# Altium project Bluetooth_Amplifier_Rev_3.PrjPcb
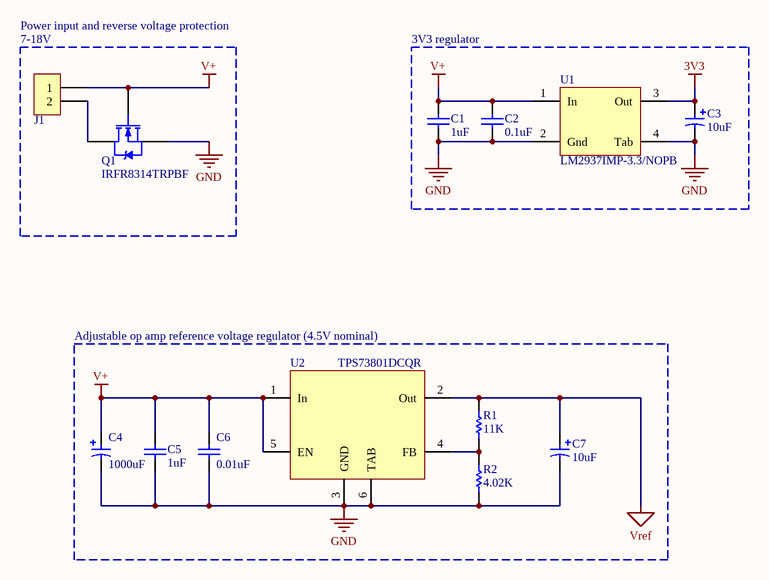
[diagram p0: Power_Supply.SchDoc]
5 sheets, 142 parts. Net scope: global (net labels, ports and power ports of the same name join across sheets).
Board file: Bluetooth_Amplifier.PcbDoc
Sheets:
  Power_Supply.SchDoc
  BC127.SchDoc
  Input_Section.SchDoc
  Power_Amplifier.SchDoc
  Filter_Section.SchDoc

## Sheet Power_Supply.SchDoc: Power Supply
size A4; Author: Yifei Li; DocumentNumber: 1; SheetNumber: 1; SheetTotal: 6

### Parts
C1  1uF  [CAPC1608X09N]
C2  0.1uF  [CAPC1608X09N]
C3  10uF  [CAPMP3216X18N]
C4  1000uF  [Nichicon UVZ 5mm]
C5  1uF  [CAPC1608X09N]
C6  0.01uF  [CAPC1608X09N]
C7  10uF  [CAPMP3216X18N]
J1  TERMINAL BLOCK 2POS  [TERMINAL BLOCK 5MM 2POS]  (value not drawn)
Q1  IRFR8314TRPBF  [DPAK229P991X239-3N]
R1  11K  [RESC1608X06N]
R2  4.02K  [RESC1608X06N]
U1  LM2937IMP-3.3/NOPB  [SOT230P700X180-4N (DCY)]
U2  TPS73801DCQR  [SOT127P705X180-6M (DCQ)]

### Blocks framed on the sheet
3V3 regulator: C1-C3 U1
Adjustable op amp reference voltage regulator (4.5V nominal): C4-C7 R1 R2 U2

### Nets
3V3: C3.1 U1.3(Out)
GND: C1.2 C2.1 C3.2 C4.2 C5.2 C6.1 C7.2 Q1.3(S) R2.1 U1.2(Gnd) U1.4(Tab) U2.3(GND) U2.6(TAB)
V+: C1.1 C2.2 C4.1 C5.1 C6.2 J1.1 Q1.1(G) U1.1(In) U2.1(In) U2.5(EN)
Vref: C7.1 R1.2 U2.2(Out)
NetJ1_2: J1.2 Q1.4(D)
NetR1_1: R1.1 R2.2 U2.4(FB)

### Notes on the sheet
- Power input and reverse voltage protection
- (near J1) 7-18V

### Library data of the parts
C1 C5 = CAP CER 1uF 0603: Manufacturer: Murata; Manufacturer Part Number: GRM188R7YA105KA12D; Voltage: 35V; Rating: X7R; Tolerance: 10%; Value: 1uF; Digikey Part Number: 490-10487-1-ND
C2 = CAP CER 0.1uF 0603: Voltage: 50V; Rating: X7R; Tolerance: 10%; Value: 0.1uF; Digikey Part Number: 490-1519-1-ND; Package: 0603
C3 C7 = CAP TANT 10uF 1.8 OHM 10V 1206: Voltage: 10V; Tolerance: 10%; ESR: 1.8 Ohm; Digikey Part Number: 399-8431-1-ND; Value: 10uF
C4 = CAP ALUM 1000uF SMD: Input Bulk Cap; Manufacturer: Nichicon; Voltage: 25V; Tolerance: 20%; Digikey Part Number: 493-1305-ND; Value: 1000uF
C6 = CAP CER 0.01uF 0603: Manufacturer: Murata; Rating: C0G; Value: 0.01uF; Digikey Part Number: 490-9666-1-ND
Q1 = MOSFET_N_CH_30V_179A_D2PAK: Reverse Voltage Power MOSFET; Manufacturer: Infineon Technologies; VDS: 30V; Rds On (Max): 2.2 mOhm @ 90A, 10V; Digikey Part Number: IRFR8314TRPBFCT-ND; Value: IRFR8314TRPBF
R1 = RES 11K 0603: Manufacturer: Yageo; Manufacturer Part Number: RC0603FR-0711KL; Tolerance: 1%; Power: 0.1W; Type: RES; Footprint: 0603; Temperature: 155dC; Digikey Part Number: 311-11.0KHRCT-ND; Value: 11K
R2 = RES 4.02K 0603: Tolerance: 1%; Type: RES; Footprint: 0603; Value: 4.02K; Digikey Part Number: 311-4.02KHRCT-ND
U2 = TPS73801DCQR: Adjustable 1.21V-20V 1A Regulator; Digikey Part Number: 296-39489-1-ND; Value: TPS73801DCQR
J1 = TERMINAL BLOCK 2POS: Digikey Part Number: ED2561-ND
U1 = LM2937IMP-3.3/NOPB: Digikey Part Number: LM2937IMP-3.3/NOPBCT-ND

## Sheet BC127.SchDoc
size A4; DocumentNumber: 2; SheetNumber: 2; SheetTotal: 6
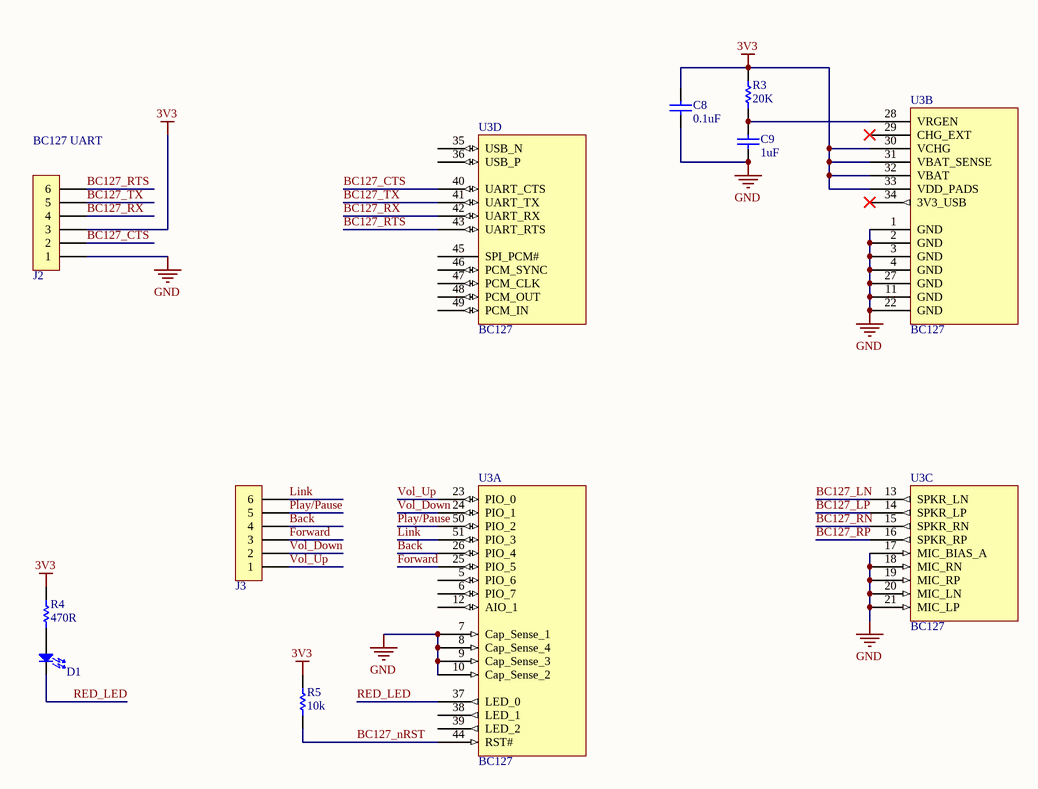
[diagram p1: BC127.SchDoc]

### Parts
C8  0.1uF  [CAPC1608X09N]
C9  1uF  [CAPC1608X09N]
D1  LED 0603  [DIOM1608X08N]  (value not drawn)
J2  6POS THRU HOLE 2.0MM  [JST PH-6]  (value not drawn)
J3  6POS THRU HOLE 2.0MM  [JST PH-6]  (value not drawn)
R3  20K  [RESC1608X06N]
R4  470R  [RESC1608X06N]
R5  10k  [RESC1608X06N]
U3  BC127  [BC127]  (parts A,B,C,D of 4)

### Nets
3V3: C8.2 J2.3 R3.2 R4.2 R5.2 U3.30(VCHG) U3.31(VBAT_SENSE) U3.32(VBAT) U3.33(VDD_PADS)
GND: C8.1 C9.1 J2.1 U3.1(GND) U3.2(GND) U3.3(GND) U3.4(GND) U3.7(Cap_Sense_1) U3.8(Cap_Sense_4) U3.9(Cap_Sense_3) U3.10(Cap_Sense_2) U3.11(GND) U3.17(MIC_BIAS_A) U3.18(MIC_RN) U3.19(MIC_RP) U3.20(MIC_LN) U3.21(MIC_LP) U3.22(GND) U3.27(GND)
Back: J3.4 U3.26(PIO_4)
BC127_CTS: J2.2 U3.40(UART_CTS)
BC127_LN: U3.13(SPKR_LN)
BC127_LP: U3.14(SPKR_LP)
BC127_nRST: R5.1 U3.44(RST#)
BC127_RN: U3.15(SPKR_RN)
BC127_RP: U3.16(SPKR_RP)
BC127_RTS: J2.6 U3.43(UART_RTS)
BC127_RX: J2.4 U3.42(UART_RX)
BC127_TX: J2.5 U3.41(UART_TX)
Forward: J3.3 U3.25(PIO_5)
Link: J3.6 U3.51(PIO_3)
Play/Pause: J3.5 U3.50(PIO_2)
RED_LED: D1.1(K2) U3.37(LED_0)
Vol_Down: J3.2 U3.24(PIO_1)
Vol_Up: J3.1 U3.23(PIO_0)
NetC9_2: C9.2 R3.1 U3.28(VRGEN)
NetD1_2: D1.2(A2) R4.1

Not connected (* = marked no-connect by the designer): U3 5(PIO_6) 6(PIO_7) 12(AIO_1) 29(CHG_EXT)* 34(3V3_USB)* 35(USB_N) 36(USB_P) 38(LED_1) 39(LED_2) 45(SPI_PCM#) 46(PCM_SYNC) 47(PCM_CLK) 48(PCM_OUT) 49(PCM_IN)

### Notes on the sheet
- (near J2) BC127 UART

### Library data of the parts
C8 = CAP CER 0.1uF 0603: as C2 on sheet Power_Supply; Value: 0.1uF; Digikey Part Number: 490-1519-1-ND; Package: 0603
C9 = CAP CER 1uF 0603: as C1 on sheet Power_Supply; Value: 1uF; Digikey Part Number: 490-10487-1-ND
D1 = LED 0603: Voltage: 2.2V; Configuration: Single; Current: 20mA; Footprint: 0603; Temperature: 85dC; Digikey Part Number: 160-1447-1-ND
R3 = RES 20K 0603: Tolerance: 1%; Power: 0.1W; Footprint: 0603; Value: 20K; Digikey Part Number: 311-20.0KHRCT-ND
R4 = RES 470R 0603: Tolerance: 1%; Power: 0.25W; Type: RES; Footprint: 0603; Value: 470R; Digikey Part Number: 311-470HRCT-ND
R5 = RES 10K 0603: Manufacturer: Yageo; Manufacturer Part Number: RC0603FR-0710KL; Tolerance: 1%; Power: 0.1W; Type: RES; Footprint: 0603; Temperature: 155dC; Digikey Part Number: 311-10.0KHRCT-ND; Value: 10k
J2 J3 = 6POS THRU HOLE 2.0MM: Digikey Part Number: 455-1708-ND

## Sheet Input_Section.SchDoc
size A4; DocumentNumber: 3; SheetNumber: 3; SheetTotal: 6
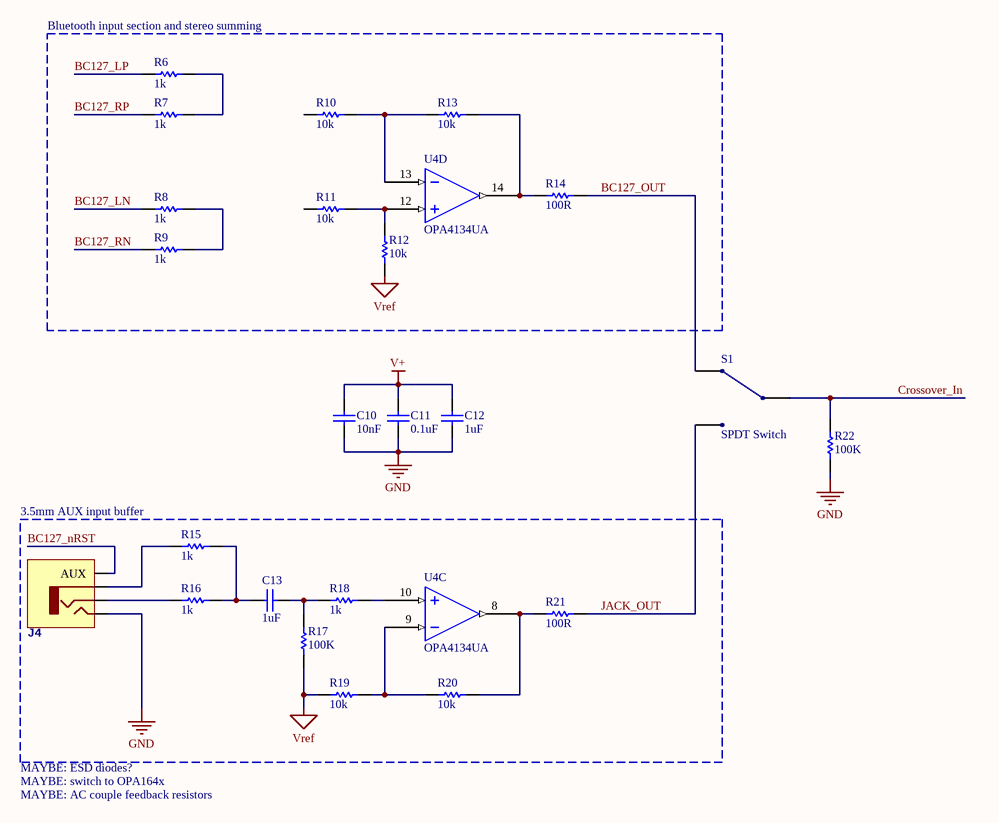
[diagram p2: Input_Section.SchDoc]

### Parts
C10  10nF  [CAPC1608X09N]
C11  0.1uF  [CAPC1608X09N]
C12  1uF  [CAPC1608X09N]
C13  1uF  [CAP Radial 5mm]
J4  3.5mm Audio Jack  [JST PH-4]  (value not drawn)
R6  1k  [RESC1608X06N]
R7  1k  [RESC1608X06N]
R8  1k  [RESC1608X06N]
R9  1k  [RESC1608X06N]
R10  10k  [RESC1608X06N]
R11  10k  [RESC1608X06N]
R12  10k  [RESC1608X06N]
R13  10k  [RESC1608X06N]
R14  100R  [RESC1608X06N]
R15  1k  [RESC1608X06N]
R16  1k  [RESC1608X06N]
R17  100K  [RESC1608X06N]
R18  1k  [RESC1608X06N]
R19  10k  [RESC1608X06N]
R20  10k  [RESC1608X06N]
R21  100R  [RESC1608X06N]
R22  100K  [RESC1608X06N]
S1  SPDT Switch  [JST PH-4]
U4  OPA4134UA  [SOIC127P600X175-14N]  (parts C,D of 4)

### Blocks framed on the sheet
Bluetooth input section and stereo summing: R6-R14 U4
3.5mm AUX input buffer: C13 J4 R15-R21 U4

### Nets
GND: C10.1 C11.1 C12.2 J4.4(LEFT) R22.1 U4.11(V-)
V+: C10.2 C11.2 C12.1
Vref: R12.1 R17.1 R19.1
BC127_LN: R8.1
BC127_LP: R6.1
BC127_nRST: J4.1(AUX)
BC127_OUT: R14.2 S1.2
BC127_RN: R9.1
BC127_RP: R7.1
Crossover_In: R22.2 S1.4
JACK_OUT: R21.2 S1.3
NetC13_1: C13.1 R15.2 R16.2
NetC13_2: C13.2 R17.2 R18.1
NetJ4_2: J4.2(SLEEVE) R15.1
NetJ4_3: J4.3(RIGHT) R16.1
NetR6_2: R6.2 R7.2
NetR8_2: R8.2 R9.2
NetR10_2: R10.2 R13.1 U4.13(-In_D)
NetR11_2: R11.2 R12.2 U4.12(+In_D)
NetR13_2: R13.2 R14.1 U4.14(Out_D)
NetR18_2: R18.2 U4.10(+In_C)
NetR19_2: R19.2 R20.1 U4.9(-In_C)
NetR20_2: R20.2 R21.1 U4.8(Out_C)

Not connected (* = marked no-connect by the designer): R10 1; R11 1; S1 1

### Notes on the sheet
- MAYBE: ESD diodes?
- MAYBE: switch to OPA164x
- MAYBE: AC couple feedback resistors

### Library data of the parts
C10 = CAP CER 10nF 0603: Bypass caps; Manufacturer: Murata; Value: 10nF; Digikey Part Number: 490-9666-1-ND
C11 = CAP CER 0.1uF 0603: as C2 on sheet Power_Supply; Value: 0.1uF; Digikey Part Number: 490-1519-1-ND; Package: 0603
C12 = CAP CER 1uF 0603: as C1 on sheet Power_Supply; Value: 1uF; Digikey Part Number: 490-10487-1-ND
C13 = CAP FILM 1uF RADIAL 5MM: Audio coupling cap; Manufacturer: EPCOS (TDK); Manufacturer P/N: B32529C105J; Voltage: 63V; Value: 1uF; Digikey Part Number: 495-1119-ND
R6-R9 R15 R16 R18 = RES 1K 0603: Manufacturer: Panasonic; Manufacturer Part Number: ERJ-PA3F1001V; Tolerance: 1%; Power: 0.25W; Type: RES; Footprint: 0603; Temperature: 155dC; Digikey Part Number: P1.0KBYCT-ND; Value: 1k
R10-R13 R19 R20 = RES 10K 0603: as R5 on sheet BC127; Type: RES; Footprint: 0603; Temperature: 155dC; Digikey Part Number: 311-10.0KHRCT-ND; Value: 10k
R14 R21 = RES 100R 0603: Tolerance: 1%; Power: 0.25W; Type: RES; Footprint: 0603; Digikey Part Number: 541-100SACT-ND; Value: 100R
R17 R22 = RES 100K 0603: Tolerance: 1%; Power: 0.1W; Footprint: 0603; Value: 100K; Digikey Part Number: 311-100KHRCT-ND
U4 = OPA4134UA: Quad OPAx134 Operational Amplifier; Digikey Part Number: 296-26284-1-ND; Value: OPA4134UA

## Sheet Power_Amplifier.SchDoc
size A4; DocumentNumber: 4; SheetNumber: 4; SheetTotal: 6
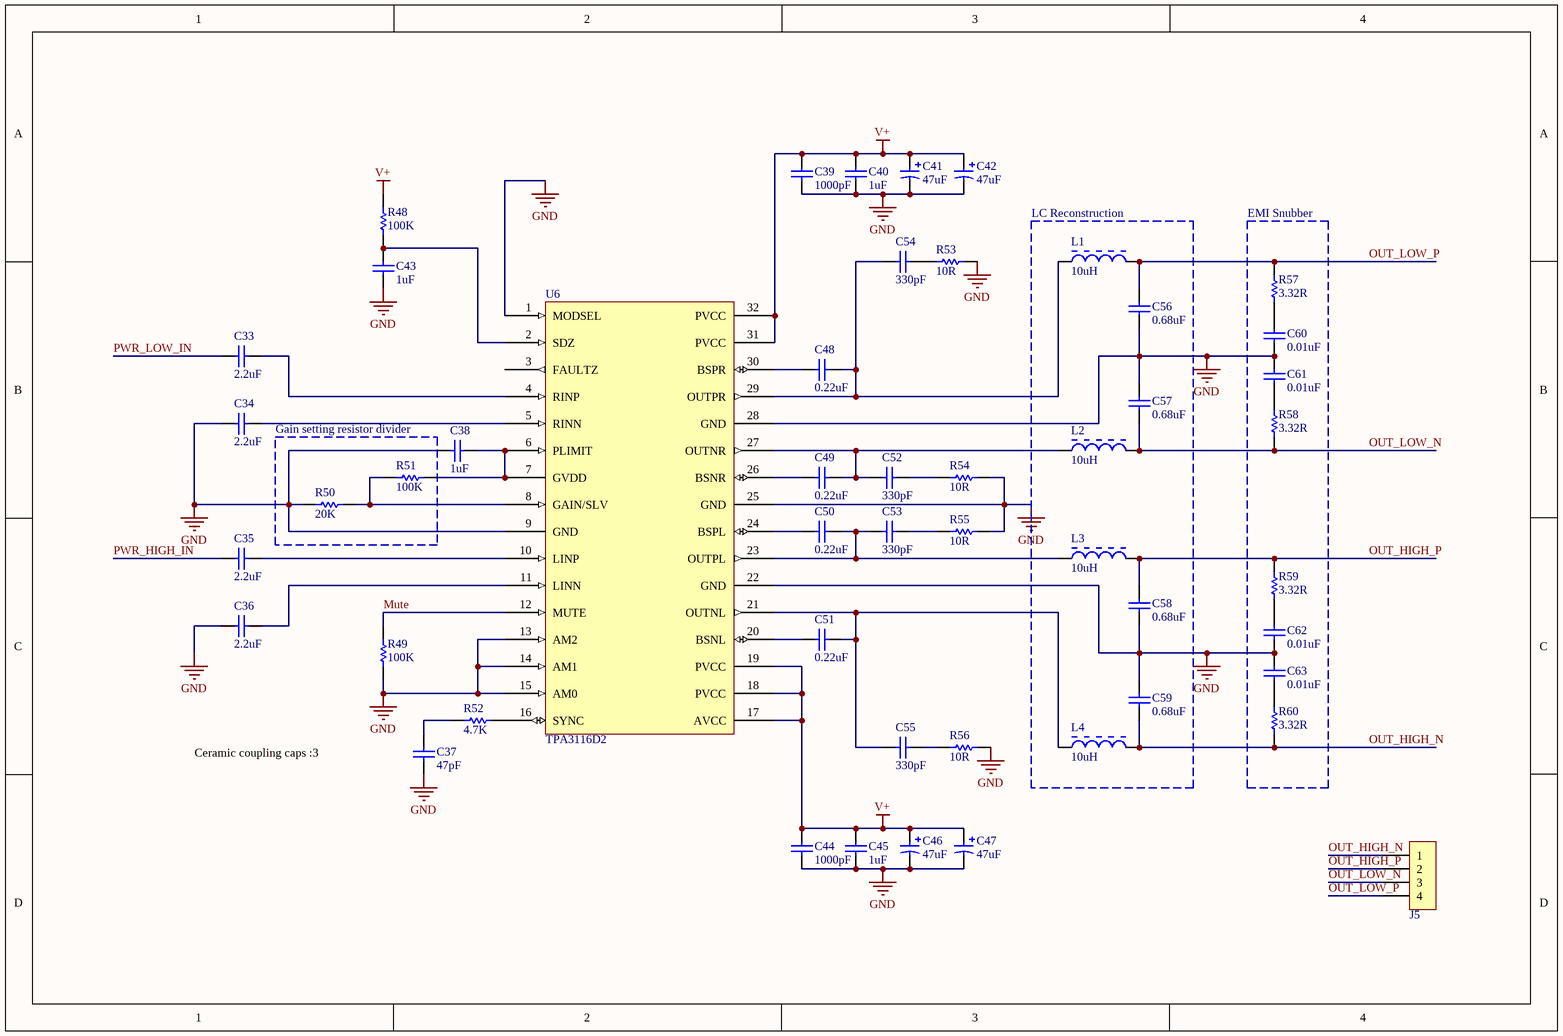
[diagram p3: Power_Amplifier.SchDoc]

### Parts
C33  2.2uF  [CAP Radial 7.5MM]
C34  2.2uF  [CAP Radial 7.5MM]
C35  2.2uF  [CAP Radial 7.5MM]
C36  2.2uF  [CAP Radial 7.5MM]
C37  47pF  [CAPC1608X09N]
C38  1uF  [CAPC1608X09N]
C39  1000pF  [CAPC1608X09N]
C40  1uF  [CAPC1608X09N]
C41  47uF  [CAP_EEFK_D]
C42  47uF  [CAP_EEFK_D]
C43  1uF  [CAPC1608X09N]
C44  1000pF  [CAPC1608X09N]
C45  1uF  [CAPC1608X09N]
C46  47uF  [CAP_EEFK_D]
C47  47uF  [CAP_EEFK_D]
C48  0.22uF  [CAPC1608X09N]
C49  0.22uF  [CAPC1608X09N]
C50  0.22uF  [CAPC1608X09N]
C51  0.22uF  [CAPC1608X09N]
C52  330pF  [CAPC1608X09N]
C53  330pF  [CAPC1608X09N]
C54  330pF  [CAPC1608X09N]
C55  330pF  [CAPC1608X09N]
C56  0.68uF  [CAP Radial 5mm]
C57  0.68uF  [CAP Radial 5mm]
C58  0.68uF  [CAP Radial 5mm]
C59  0.68uF  [CAP Radial 5mm]
C60  0.01uF  [CAPC1608X09N]
C61  0.01uF  [CAPC1608X09N]
C62  0.01uF  [CAPC1608X09N]
C63  0.01uF  [CAPC1608X09N]
J5  TERMINAL BLOCK 4POS  [TERMINAL BLOCK 5MM 4POS]  (value not drawn)
L1  10uH  [ICE 1D10A]
L2  10uH  [ICE 1D10A]
L3  10uH  [ICE 1D10A]
L4  10uH  [ICE 1D10A]
R48  100K  [RESC1608X06N]
R49  100K  [RESC1608X06N]
R50  20K  [RESC1608X06N]
R51  100K  [RESC1608X06N]
R52  4.7K  [RESC1608X06N]
R53  10R  [RESC1608X06N]
R54  10R  [RESC1608X06N]
R55  10R  [RESC1608X06N]
R56  10R  [RESC1608X06N]
R57  3.32R  [RESC1608X06N]
R58  3.32R  [RESC1608X06N]
R59  3.32R  [RESC1608X06N]
R60  3.32R  [RESC1608X06N]
U6  TPA3116D2  [DAP0032A]

### Blocks framed on the sheet
LC Reconstruction: C56-C59 L1-L4
EMI Snubber: C60-C63 R57-R60
Gain setting resistor divider: R50 R51

### Nets
GND: C34.1 C36.1 C37.1 C38.2 C39.1 C40.1 C41.2 C42.2 C43.1 C44.1 C45.1 C46.2 C47.2 C56.1 C57.2 C58.1 C59.2 C60.1 C61.2 C62.1 C63.2 R49.1 R50.1 R53.2 R54.2 R55.2 R56.2 U6.1(MODSEL) U6.9(GND) U6.13(AM2) U6.14(AM1) U6.15(AM0) U6.22(GND) U6.25(GND) U6.28(GND) U6.33(POWERPAD)
V+: C39.2 C40.2 C41.1 C42.1 C44.2 C45.2 C46.1 C47.1 R48.2 U6.17(AVCC) U6.18(PVCC) U6.19(PVCC) U6.31(PVCC) U6.32(PVCC)
Mute: R49.2 U6.12(MUTE)
OUT_HIGH_N: C59.1 J5.1 L4.2 R60.1
OUT_HIGH_P: C58.2 J5.2 L3.2 R59.2
OUT_LOW_N: C57.1 J5.3 L2.2 R58.1
OUT_LOW_P: C56.2 J5.4 L1.2 R57.2
PWR_HIGH_IN: C35.1
PWR_LOW_IN: C33.1
NetC33_2: C33.2 U6.4(RINP)
NetC34_2: C34.2 U6.5(RINN)
NetC35_2: C35.2 U6.10(LINP)
NetC36_2: C36.2 U6.11(LINN)
NetC37_2: C37.2 R52.1
NetC38_1: C38.1 R51.2 U6.6(PLIMIT) U6.7(GVDD)
NetC43_2: C43.2 R48.1 U6.2(SDZ)
NetC48_1: C48.1 U6.30(BSPR)
NetC48_2: C48.2 C54.1 L1.1 U6.29(OUTPR)
NetC49_1: C49.1 U6.26(BSNR)
NetC49_2: C49.2 C52.1 L2.1 U6.27(OUTNR)
NetC50_1: C50.1 U6.24(BSPL)
NetC50_2: C50.2 C53.1 L3.1 U6.23(OUTPL)
NetC51_1: C51.1 U6.20(BSNL)
NetC51_2: C51.2 C55.1 L4.1 U6.21(OUTNL)
NetC52_2: C52.2 R54.1
NetC53_2: C53.2 R55.1
NetC54_2: C54.2 R53.1
NetC55_2: C55.2 R56.1
NetC60_2: C60.2 R57.1
NetC61_1: C61.1 R58.2
NetC62_2: C62.2 R59.1
NetC63_1: C63.1 R60.2
NetR50_2: R50.2 R51.1 U6.8(GAIN/SLV)
NetR52_2: R52.2 U6.16(SYNC)

Not connected (* = marked no-connect by the designer): U6 3(FAULTZ)

### Notes on the sheet
- Ceramic coupling caps :3

### Library data of the parts
C33-C36 = CAP FILM 2.2uF RADIAL 7.5MM: Audio coupling cap; Manufacturer: EPCOS (TDK); Manufacturer P/N: B32520C225K; Voltage: 40V; Value: 2.2uF; Digikey Part Number: 495-4814-ND
C37 = CAP CER 47pF 0603: Rating: C0G; Voltage: 50V; Value: 47pF; Digikey Part Number: 490-1419-1-ND
C38 C40 C43 C45 = CAP CER 1uF 0603: as C1 on sheet Power_Supply; Value: 1uF; Digikey Part Number: 490-10487-1-ND
C39 C44 = CAP CER 1000pF 0603: Manufacturer: Murata; Rating: C0G; Voltage: 50V; Value: 1000pF; Digikey Part Number: 490-1451-1-ND
C41 C42 C46 C47 = CAP ALUM 47uF SMD: Manufacturer: Panasonic; Voltage: 35V; Digikey Part Number: PCE3842CT-ND; Value: 47uF
C48-C51 = CAP CER 0.22uF 0603: Manufacturer: Murata; Voltage: 50V; Rating: X7R; Value: 0.22uF; Digikey Part Number: 1276-1111-1-ND
C52-C55 = CAP CER 330pF 0603: Manufacturer: Murata; Rating: C0G; Voltage: 50V; Value: 330pF; Digikey Part Number: 490-1439-1-ND
C56-C59 = CAP 0.68uF Radial 5mm: Output Cap; Manufacturer: EPCOS (TDK); Voltage: 63V; Value: 0.68uF; Digikey Part Number: 495-1114-ND
C60-C63 = CAP CER 0.01uF 0603: Manufacturer: Murata; Rating: C0G; Value: 0.01uF; Digikey Part Number: 490-9666-1-ND
L1-L4 = IND 10uH 4.5A THRU: Manufacturer: Ice Components; Manufacturer P/N: 1D10A-100M; DCR: 20.5mOhm; Value: 10uH; Mouser P/N: 911-1D10A-100M
R48 R49 R51 = RES 100K 0603: Tolerance: 1%; Power: 0.1W; Footprint: 0603; Value: 100K; Digikey Part Number: 311-100KHRCT-ND
R50 = RES 20K 0603: Tolerance: 1%; Power: 0.1W; Footprint: 0603; Value: 20K; Digikey Part Number: 311-20.0KHRCT-ND
R52 = RES 4.7K 0603: Tolerance: 1%; Type: RES; Footprint: 0603; Value: 4.7K; Digikey Part Number: 311-4.70KHRCT-ND
R53-R56 = RES 10R 0603: Tolerance: 1%; Power: 0.25W; Type: RES; Footprint: 0603; Digikey Part Number: RHM10.0ADCT-ND; Value: 10R
R57-R60 = RES 3.32R 0603: Tolerance: 1%; Power: 0.1W; Type: RES; Footprint: 0603; Digikey Part Number: 311-3.32HRCT-ND; Value: 3.32R
J5 = TERMINAL BLOCK 4POS: Digikey Part Number: ED2563-ND
U6 = TPA3116D2: Digikey Part Number: 296-39337-1-ND

## Sheet Filter_Section.SchDoc
size A3; DocumentNumber: 5; SheetNumber: 5; SheetTotal: 6
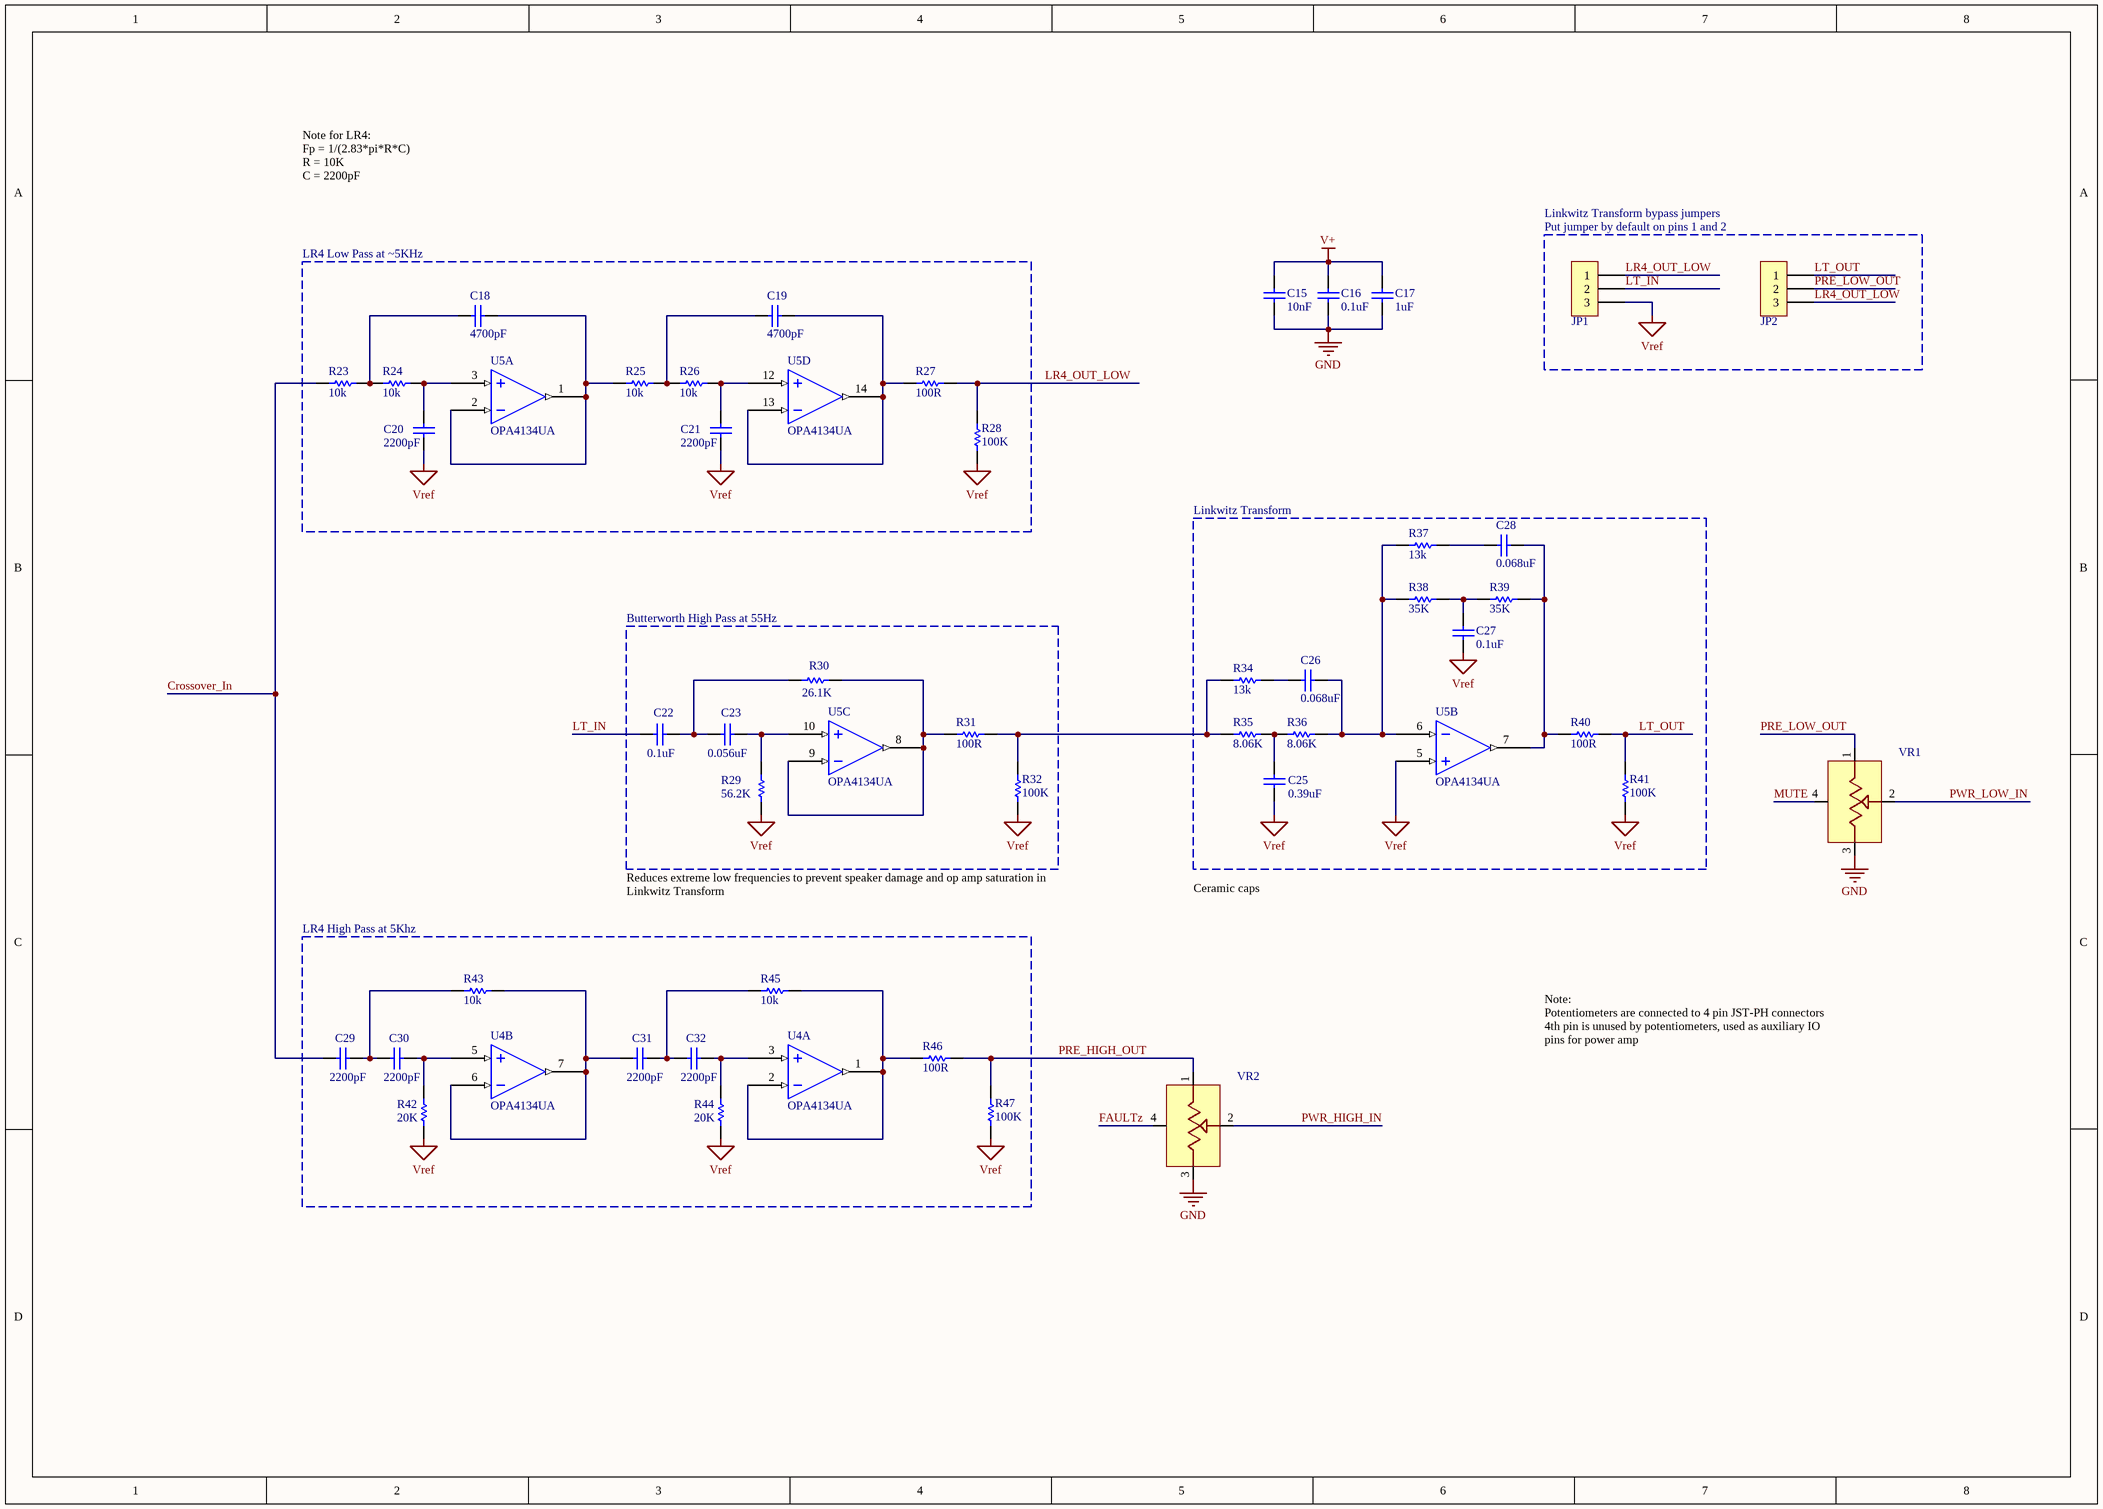
[diagram p4: Filter_Section.SchDoc]

### Parts
C15  10nF  [CAPC1608X09N]
C16  0.1uF  [CAPC1608X09N]
C17  1uF  [CAPC1608X09N]
C18  4700pF  [CAPC1608X09N]
C19  4700pF  [CAPC1608X09N]
C20  2200pF  [CAPC1608X09N]
C21  2200pF  [CAPC1608X09N]
C22  0.1uF  [CAPC3216X18N]
C23  0.056uF  [CAPC3216X18N]
C25  0.39uF  [CAP Radial 5mm]
C26  0.068uF  [CAPC3216X18N]
C27  0.1uF  [CAPC3216X18N]
C28  0.068uF  [CAPC3216X18N]
C29  2200pF  [CAPC1608X09N]
C30  2200pF  [CAPC1608X09N]
C31  2200pF  [CAPC1608X09N]
C32  2200pF  [CAPC1608X09N]
JP1  JUMPER 3POS THRU HOLE 2.54MM  [3 Position 2.54MM Thru-Hole]  (value not drawn)
JP2  JUMPER 3POS THRU HOLE 2.54MM  [3 Position 2.54MM Thru-Hole]  (value not drawn)
R23  10k  [RESC1608X06N]
R24  10k  [RESC1608X06N]
R25  10k  [RESC1608X06N]
R26  10k  [RESC1608X06N]
R27  100R  [RESC1608X06N]
R28  100K  [RESC1608X06N]
R29  56.2K  [RESC1608X06N]
R30  26.1K  [RESC1608X06N]
R31  100R  [RESC1608X06N]
R32  100K  [RESC1608X06N]
R34  13k  [RESC1608X06N]
R35  8.06K  [RESC1608X06N]
R36  8.06K  [RESC1608X06N]
R37  13k  [RESC1608X06N]
R38  35K  [RESC1608X06N]
R39  35K  [RESC1608X06N]
R40  100R  [RESC1608X06N]
R41  100K  [RESC1608X06N]
R42  20K  [RESC1608X06N]
R43  10k  [RESC1608X06N]
R44  20K  [RESC1608X06N]
R45  10k  [RESC1608X06N]
R46  100R  [RESC1608X06N]
R47  100K  [RESC1608X06N]
U4  OPA4134UA  [SOIC127P600X175-14N]  (parts A,B of 4)
U5  OPA4134UA  [SOIC127P600X175-14N]  (parts A,B,C,D of 4)
VR1  *  [JST PH-4]  (value not drawn)
VR2  *  [JST PH-4]  (value not drawn)

### Blocks framed on the sheet
LR4 Low Pass at ~5KHz: C18-C21 R23-R28 U5
Linkwitz Transform: C25-C28 R34-R41 U5
Butterworth High Pass at 55Hz: C22 C23 R29-R32 U5
LR4 High Pass at 5Khz: C29-C32 R42-R47 U4

### Nets
GND: C15.1 C16.1 C17.2 U5.11(V-) VR1.3(B) VR2.3(B)
V+: C15.2 C16.2 C17.1 U4.4(V+) U5.4(V+)
Vref: C20.1 C21.1 C25.1 C27.2 JP1.3 R28.1 R29.1 R32.1 R41.1 R42.1 R44.2 R47.1 U5.5(+In_B)
Crossover_In: C29.1 R23.1
FAULTz: VR2.4
LR4_OUT_LOW: JP1.1 JP2.3 R27.2 R28.2
LT_IN: C22.1 JP1.2
LT_OUT: JP2.1 R40.2 R41.2
Mute: VR1.4
PRE_HIGH_OUT: R46.2 R47.2 VR2.1(A)
PRE_LOW_OUT: JP2.2 VR1.1(A)
PWR_HIGH_IN: VR2.2(W)
PWR_LOW_IN: VR1.2(W)
NetC18_1: C18.1 R23.2 R24.1
NetC18_2: C18.2 R25.1 U5.1(Out_A) U5.2(-In_A)
NetC19_1: C19.1 R25.2 R26.1
NetC19_2: C19.2 R27.1 U5.13(-In_D) U5.14(Out_D)
NetC20_2: C20.2 R24.2 U5.3(+In_A)
NetC21_2: C21.2 R26.2 U5.12(+In_D)
NetC22_2: C22.2 C23.1 R30.1
NetC23_2: C23.2 R29.2 U5.10(+In_C)
NetC25_2: C25.2 R35.2 R36.1
NetC26_1: C26.1 R34.2
NetC26_2: C26.2 R36.2 R37.1 R38.1 U5.6(-In_B)
NetC27_1: C27.1 R38.2 R39.1
NetC28_1: C28.1 R37.2
NetC28_2: C28.2 R39.2 R40.1 U5.7(Out_B)
NetC29_2: C29.2 C30.1 R43.1
NetC30_2: C30.2 R42.2 U4.5(+In_B)
NetC31_1: C31.1 R43.2 U4.6(-In_B) U4.7(Out_B)
NetC31_2: C31.2 C32.1 R45.1
NetC32_2: C32.2 R44.1 U4.3(+In_A)
NetR30_2: R30.2 R31.1 U5.8(Out_C) U5.9(-In_C)
NetR31_2: R31.2 R32.2 R34.1 R35.1
NetR45_2: R45.2 R46.1 U4.1(Out_A) U4.2(-In_A)

### Notes on the sheet
- Note for LR4:
  Fp = 1/(2.83*pi*R*C)
  R = 10K
  C = 2200pF
  Fp = 5112.6Hz
- Linkwitz Transform bypass jumpers
- Put jumper by default on pins 1 and 2
- Reduces extreme low frequencies to prevent speaker damage and op amp saturation in Linkwitz Transform
- Ceramic caps
- Note:
  Potentiometers are connected to 4 pin JST-PH connectors
  4th pin is unused by potentiometers, used as auxiliary IO pins for power amp

### Library data of the parts
C15 = CAP CER 10nF 0603: Bypass caps; Manufacturer: Murata; Value: 10nF; Digikey Part Number: 490-9666-1-ND
C16 = CAP CER 0.1uF 0603: as C2 on sheet Power_Supply; Value: 0.1uF; Digikey Part Number: 490-1519-1-ND; Package: 0603
C17 = CAP CER 1uF 0603: as C1 on sheet Power_Supply; Value: 1uF; Digikey Part Number: 490-10487-1-ND
C18 C19 = CAP CER 4700pF 0603: Manufacturer: TDK; Voltage: 100V; Tolerance: 5%; Rating: C0G; Value: 4700pF; Digikey Part Number: 445-172684-1-ND
C20 C21 C29-C32 = CAP CER 2200pF 0603: Manufacturer: Murata; Voltage: 50V; Tolerance: 1%; Rating: C0G; Value: 2200pF; Digikey Part Number: 490-7768-1-ND
C22 C27 = CAP CER 0.1uF C0G 1206: Voltage: 25V; Rating: C0G; Tolerance: 5%; Value: 0.1uF; Digikey Part Number: 490-1767-1-ND; Package: 1206
C23 = CAP CER 0.056uF C0G 1206: Voltage: 50V; Rating: C0G; Tolerance: 5%; Value: 0.056uF; Digikey Part Number: 490-8347-1-ND; Package: 1206
C25 = CAP 0.39uF Radial 5mm: Film cap in LT; Manufacturer: EPCOS (TDK); Manufacturer P/N: B32529C105J; Voltage: 63V; Value: 0.39uF; Digikey Part Number: 495-4846-1-ND
C26 C28 = CAP CER 0.068uF 1206: Voltage: 100V; Rating: C0G; Tolerance: 5%; Value: 0.068uF; Digikey Part Number: 445-172693-1-ND; Package: 1206
R23-R26 R43 R45 = RES 10K 0603: as R5 on sheet BC127; Type: RES; Footprint: 0603; Temperature: 155dC; Digikey Part Number: 311-10.0KHRCT-ND; Value: 10k
R27 R31 R40 R46 = RES 100R 0603: Tolerance: 1%; Power: 0.25W; Type: RES; Footprint: 0603; Digikey Part Number: 541-100SACT-ND; Value: 100R
R28 R32 R41 R47 = RES 100K 0603: Tolerance: 1%; Power: 0.1W; Footprint: 0603; Value: 100K; Digikey Part Number: 311-100KHRCT-ND
R29 = RES 56.2K 0603: Manufacturer: Yageo; Manufacturer Part Number: RC0603FR-0756K2L; Tolerance: 1%; Power: 0.1W; Type: RES; Footprint: 0603; Temperature: 155dC; Digikey Part Number: 311-56.2KHRCT-ND; Value: 56.2K
R30 = RES 26.1K 0603: Manufacturer: Yageo; Manufacturer Part Number: RC0603FR-0726K1L; Tolerance: 1%; Power: 0.1W; Type: RES; Footprint: 0603; Temperature: 155dC; Digikey Part Number: 311-26.1KHRCT-ND; Value: 26.1K
R34 R37 = RES 13K 0603: Tolerance: 1%; Type: RES; Footprint: 0603; Value: 13k; Digikey Part Number: 311-13.0KHRCT-ND
R35 R36 = RES 8.06K 0603: Manufacturer: Yageo; Tolerance: 1%; Power: 0.1W; Type: RES; Footprint: 0603; Digikey Part Number: 311-8.06KHRCT-ND; Value: 8.06K
R38 R39 = RES 35K 0603: Tolerance: 1%; Type: RES; Footprint: 0603; Value: 35K; Digikey Part Number: 311-34.8KHRCT-ND
R42 R44 = RES 20K 0603: Tolerance: 1%; Power: 0.1W; Footprint: 0603; Value: 20K; Digikey Part Number: 311-20.0KHRCT-ND
U4 U5 = OPA4134UA: Quad OPAx134 Operational Amplifier; Digikey Part Number: 296-26284-1-ND; Value: OPA4134UA
VR1 VR2 = Potentiometer: Value: *

## Nets that join several sheets
3V3: Power_Supply (C3.1 U1.3), BC127 (9 pins)
GND: Power_Supply (13 pins), BC127 (19 pins), Input_Section (6 pins), Power_Amplifier (36 pins), Filter_Section (6 pins)
V+: Power_Supply (10 pins), Input_Section (C10.2 C11.2 C12.1), Power_Amplifier (14 pins), Filter_Section (5 pins)
Vref: Power_Supply (C7.1 R1.2 U2.2), Input_Section (R12.1 R17.1 R19.1), Filter_Section (13 pins)
BC127_LN: BC127 (U3.13), Input_Section (R8.1)
BC127_LP: BC127 (U3.14), Input_Section (R6.1)
BC127_nRST: BC127 (R5.1 U3.44), Input_Section (J4.1)
BC127_RN: BC127 (U3.15), Input_Section (R9.1)
BC127_RP: BC127 (U3.16), Input_Section (R7.1)
Crossover_In: Input_Section (R22.2 S1.4), Filter_Section (C29.1 R23.1)
Mute: Power_Amplifier (R49.2 U6.12), Filter_Section (VR1.4)
PWR_HIGH_IN: Power_Amplifier (C35.1), Filter_Section (VR2.2)
PWR_LOW_IN: Power_Amplifier (C33.1), Filter_Section (VR1.2)